# Altium schematic sheet Tempmeting.SchDoc
size A; SheetNumber: 4; SheetTotal: 5
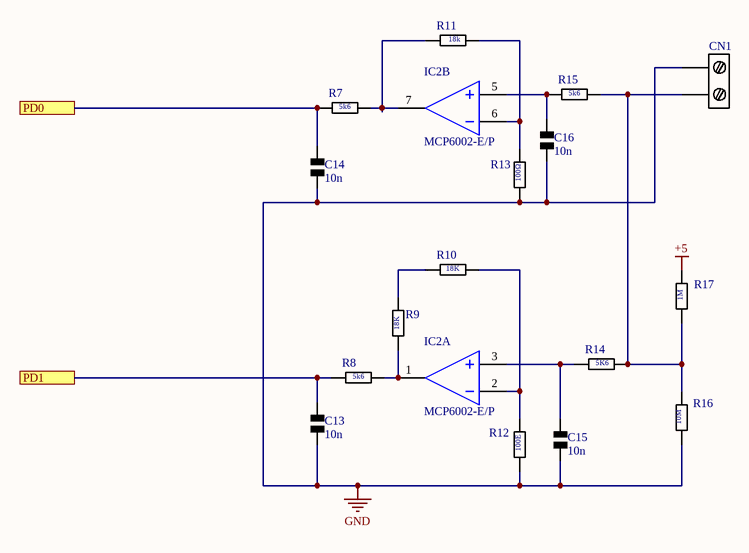
[diagram p0: Tempmeting.SchDoc]

## Parts
C13  10n  [Capacitor]
C14  10n  [Capacitor]
C15  10n  [Capacitor]
C16  10n  [Capacitor]
CN1  (no value)  [K1,K2,K3,K8 Printkroonsteen]
IC2  MCP6002-E/P  [MCP6002]  (parts A,B of 2)
R7  5k6  [Resistor]
R8  5k6  [Resistor]
R9  18K  [Resistor]
R10  18K  [Resistor]
R11  18k  [Resistor]
R12  100E  [Resistor]
R13  100Ω  [Resistor]
R14  5K6  [Resistor]
R15  5k6  [Resistor]
R16  10M  [Resistor]
R17  1M  [Resistor]

## Ports
PD0 (see Soldeer Station[4B]), PD1 (see Soldeer Station[4B])

## Nets
+5: R17.2
GND: C13.1 C14.1 C15.1 C16.1 CN1.1 R12.1 R13.1 R16.1
PD0: C14.2 R7.1 ; port PD0
PD1: C13.2 R8.1 ; port PD1
NetC15_2: C15.2 IC2.3(VINA+) R14.1
NetC16_2: C16.2 IC2.5(VINB+) R15.1
NetCN1_2: CN1.2 R14.2 R15.2 R16.2 R17.1
NetIC2_1: IC2.1(VOUTA) R8.2 R9.1
NetIC2_2: IC2.2(VINA-) R10.2 R12.2
NetIC2_6: IC2.6(VINB-) R11.2 R13.2
NetIC2_7: IC2.7(VOUTB) R7.2 R11.1
NetR9_2: R9.2 R10.1

## Library data of the parts
C13-C16 = Condensator: Manufacturer: Kemet; Part Number: C0402C104K4RACTU
CN1 = K1,K2,K3,K8 Printkroonsteen: MF: TE Connectivity; MP: 282837-2; SnapEDA_Link: https://www.snapeda.com/parts/282837-2/TE+Connectivity+AMP+Connectors/view-part/?ref=snap; Price: None; Check_prices: https://www.snapeda.com/parts/282837-2/TE+Connectivity+AMP+Connectors/view-part/?ref=eda; Purchase-URL: https://pricing.snapeda.com/search/part/282837-2/?ref=eda; Value: *; Availability: In Stock; Package: None
IC2 = MCP6002: None; Slew Rate: 0.6V/µs; Supply Current: 100uA; Power Supply Rejection Ratio (PSRR): 86dB; Input Offset Voltage (Vos): 4.5mV; Input Bias Current: 1pA; Amplifier Type: GENERAL PURPOSE; Unity Gain Bandwidth Product: 1MHz; Number of Circuits: 2; Output Current: 23mA; Operating Supply Voltage: 5.5V; Min Supply Voltage: 1.8V; Common Mode Rejection Ratio: 60dB; Voltage Gain: 112dB; Max Supply Voltage: 6V; Package Quantity: 60; REACH SVHC: No SVHC; Min Operating Temperature: -40°C; Max Operating Temperature: 125°C; Mount: Through Hole; Nominal Supply Current: 100uA; Height: 3.3mm; Length: 9.27mm; Slew Rate-Nom: 0.6V/µs; Packaging: Rail/Tube; Output Current per Channel: 23mA; Number of Amplifiers: 2; RoHS Compliant: Yes; Radiation Hardening: No; Bandwidth: 1MHz; Lead Free: Lead Free; Width: 6.35mm; Number of Channels: 2; Gain Bandwidth Product: 1MHz; Technology: CMOS; Operating Supply Current: 100uA; Number of Elements: 2; Number of Pins: 8; Input Offset Voltage-Max: 4.5mV; Case/Package: PDIP
R7-R17 = Resistor: Manufacturer: Vishay Dale; Part Number: CRCW08050000Z0EA